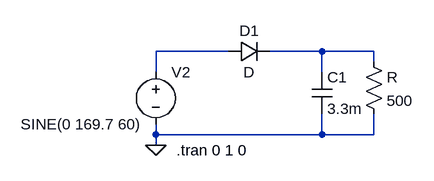
[diagram p0: schematic ex2.asc]
ex2.asc, the LTspice schematic file:
Version 4
SHEET 1 880 680
WIRE 16 -32 -96 -32
WIRE 160 -32 80 -32
WIRE 240 -32 160 -32
WIRE 240 -16 240 -32
WIRE -96 0 -96 -32
WIRE 160 0 160 -32
WIRE -96 96 -96 80
WIRE 160 96 160 64
WIRE 160 96 -96 96
WIRE 240 96 240 64
WIRE 240 96 160 96
WIRE -96 112 -96 96
FLAG -96 112 0
SYMBOL voltage -96 -16 R0
WINDOW 123 0 0 Left 0
WINDOW 39 0 0 Left 0
WINDOW 3 -208 96 Left 2
SYMATTR Value SINE(0 169.7 60)
SYMATTR InstName V2
SYMBOL res 224 -32 R0
SYMATTR InstName R
SYMATTR Value 500
SYMBOL cap 144 0 R0
SYMATTR InstName C1
SYMATTR Value 3.3m
SYMBOL diode 16 -16 R270
WINDOW 0 32 32 VTop 2
WINDOW 3 0 32 VBottom 2
SYMATTR InstName D1
TEXT -64 120 Left 2 !.tran 0 1 0

The netlist it stands for:
* ex2.asc
V2 N001 0 SINE(0 169.7 60)
R N002 0 500
C1 N002 0 3.3m
D1 N001 N002 D
.model D D
.lib standard.dio
.tran 0 1 0
.backanno
.end